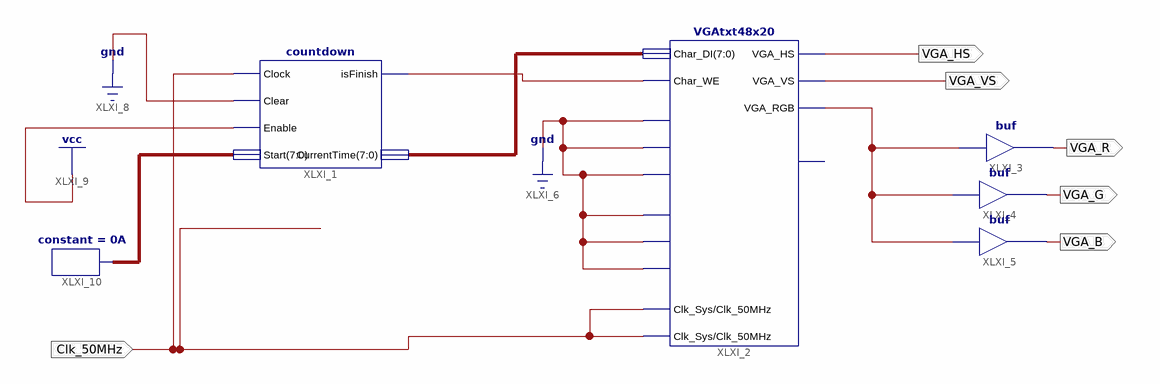
[diagram p0: schematic sheet 1]
// Xilinx ISE schematic schemat.sch (spartan3e) as structural Verilog: 6 symbols, 6 ports
module schemat (
  input  Clk_50MHz,
  output VGA_HS,
  output VGA_VS,
  output VGA_R,
  output VGA_G,
  output VGA_B
);

  wire XLXN_3, XLXN_7;
  wire [7:0] XLXN_8, XLXN_19;

  countdown XLXI_1 (
    .Clock(Clk_50MHz), .Clear(1'b0), .Enable(1'b1), .Start(XLXN_19), .isFinish(XLXN_7), .CurrentTime(XLXN_8));
  VGAtxt48x20 XLXI_2 (
    .Char_DI(XLXN_8), .Home(1'b0), .NewLine(1'b0), .Goto00(1'b0), .Clk_Sys(Clk_50MHz), .Clk_50MHz(Clk_50MHz),
    .CursorOn(1'b0), .ScrollEn(1'b0), .ScrollClear(1'b0), .VGA_HS(VGA_HS), .VGA_VS(VGA_VS), .VGA_RGB(XLXN_3),
    .Char_WE(XLXN_7));  // open: Busy
  buf XLXI_3 (VGA_R, XLXN_3);
  buf XLXI_4 (VGA_G, XLXN_3);
  buf XLXI_5 (VGA_B, XLXN_3);
  constant #(.CValue("0A")) XLXI_10 (.O(XLXN_19));
endmodule
